# Altium project IPG.PrjPcb (part 11 of 13)

## Sheet 13-Digital.SchDoc: Digital Sense Channel
size A2; Date: 18/12/2023; DocumentNumber: 13; SheetNumber: 13; SheetTotal: 15
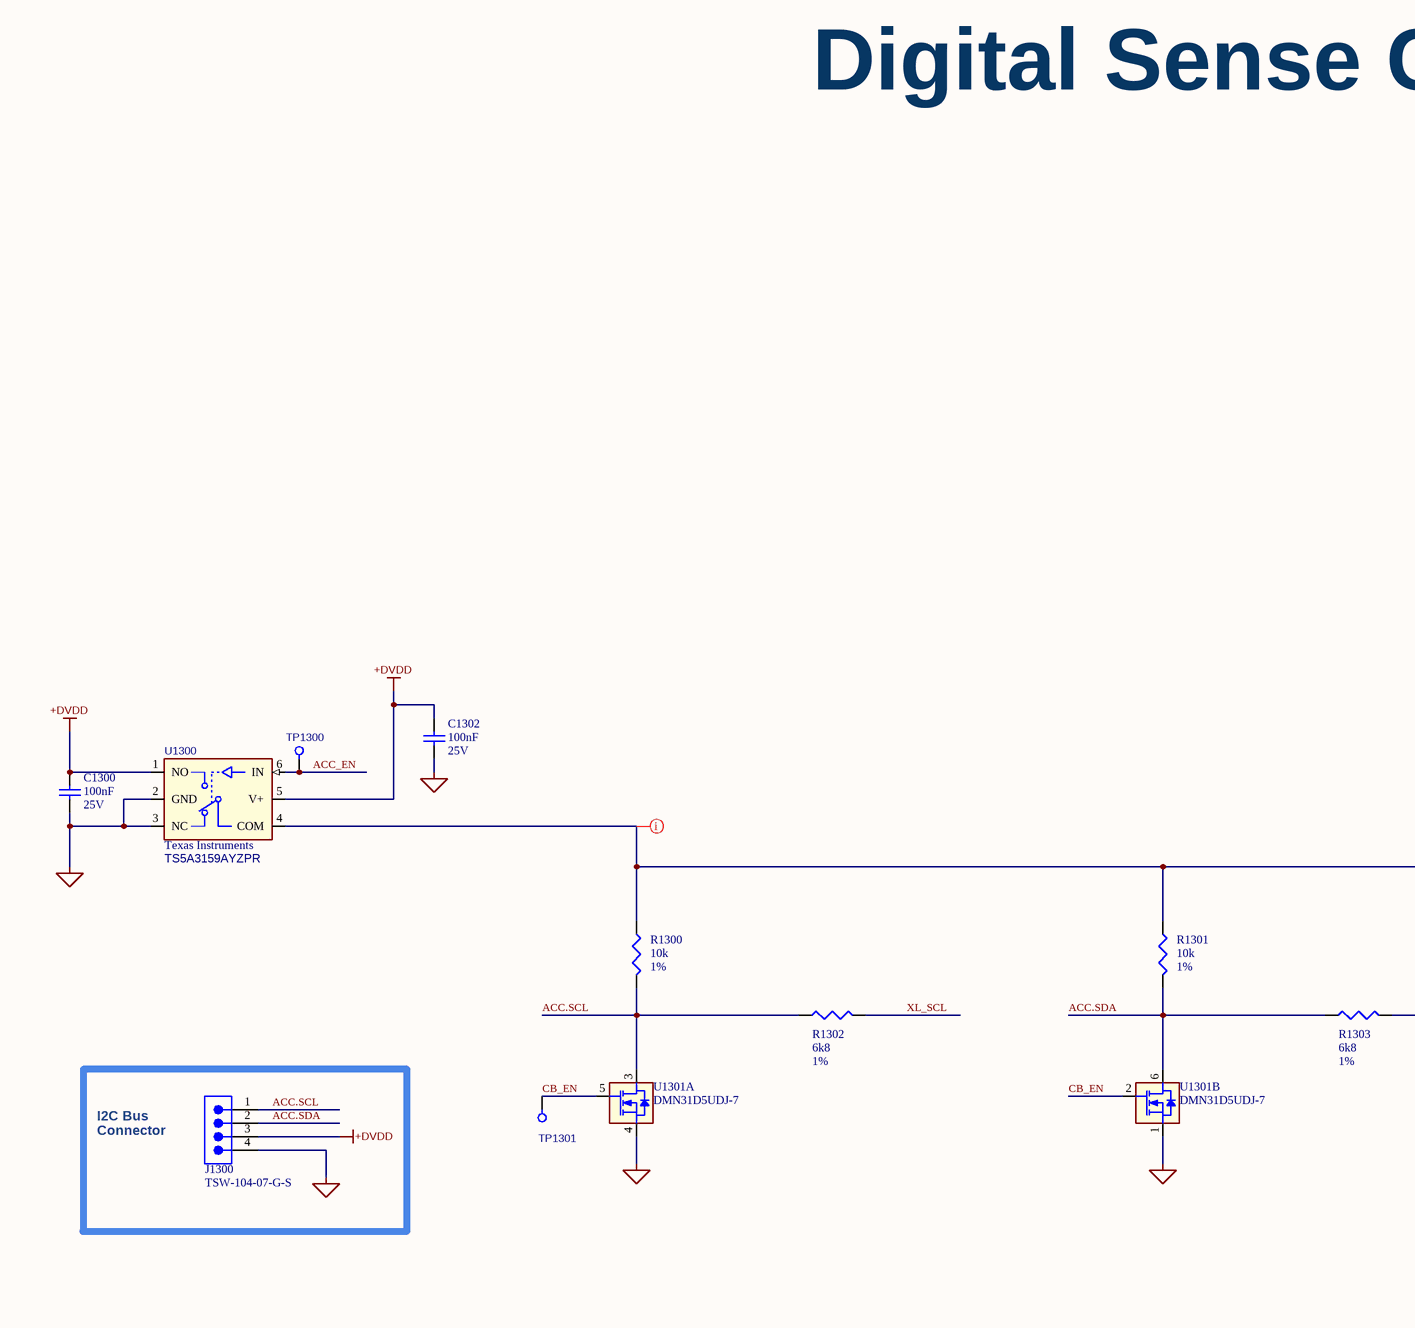
[diagram p27: 13-Digital.SchDoc, left]
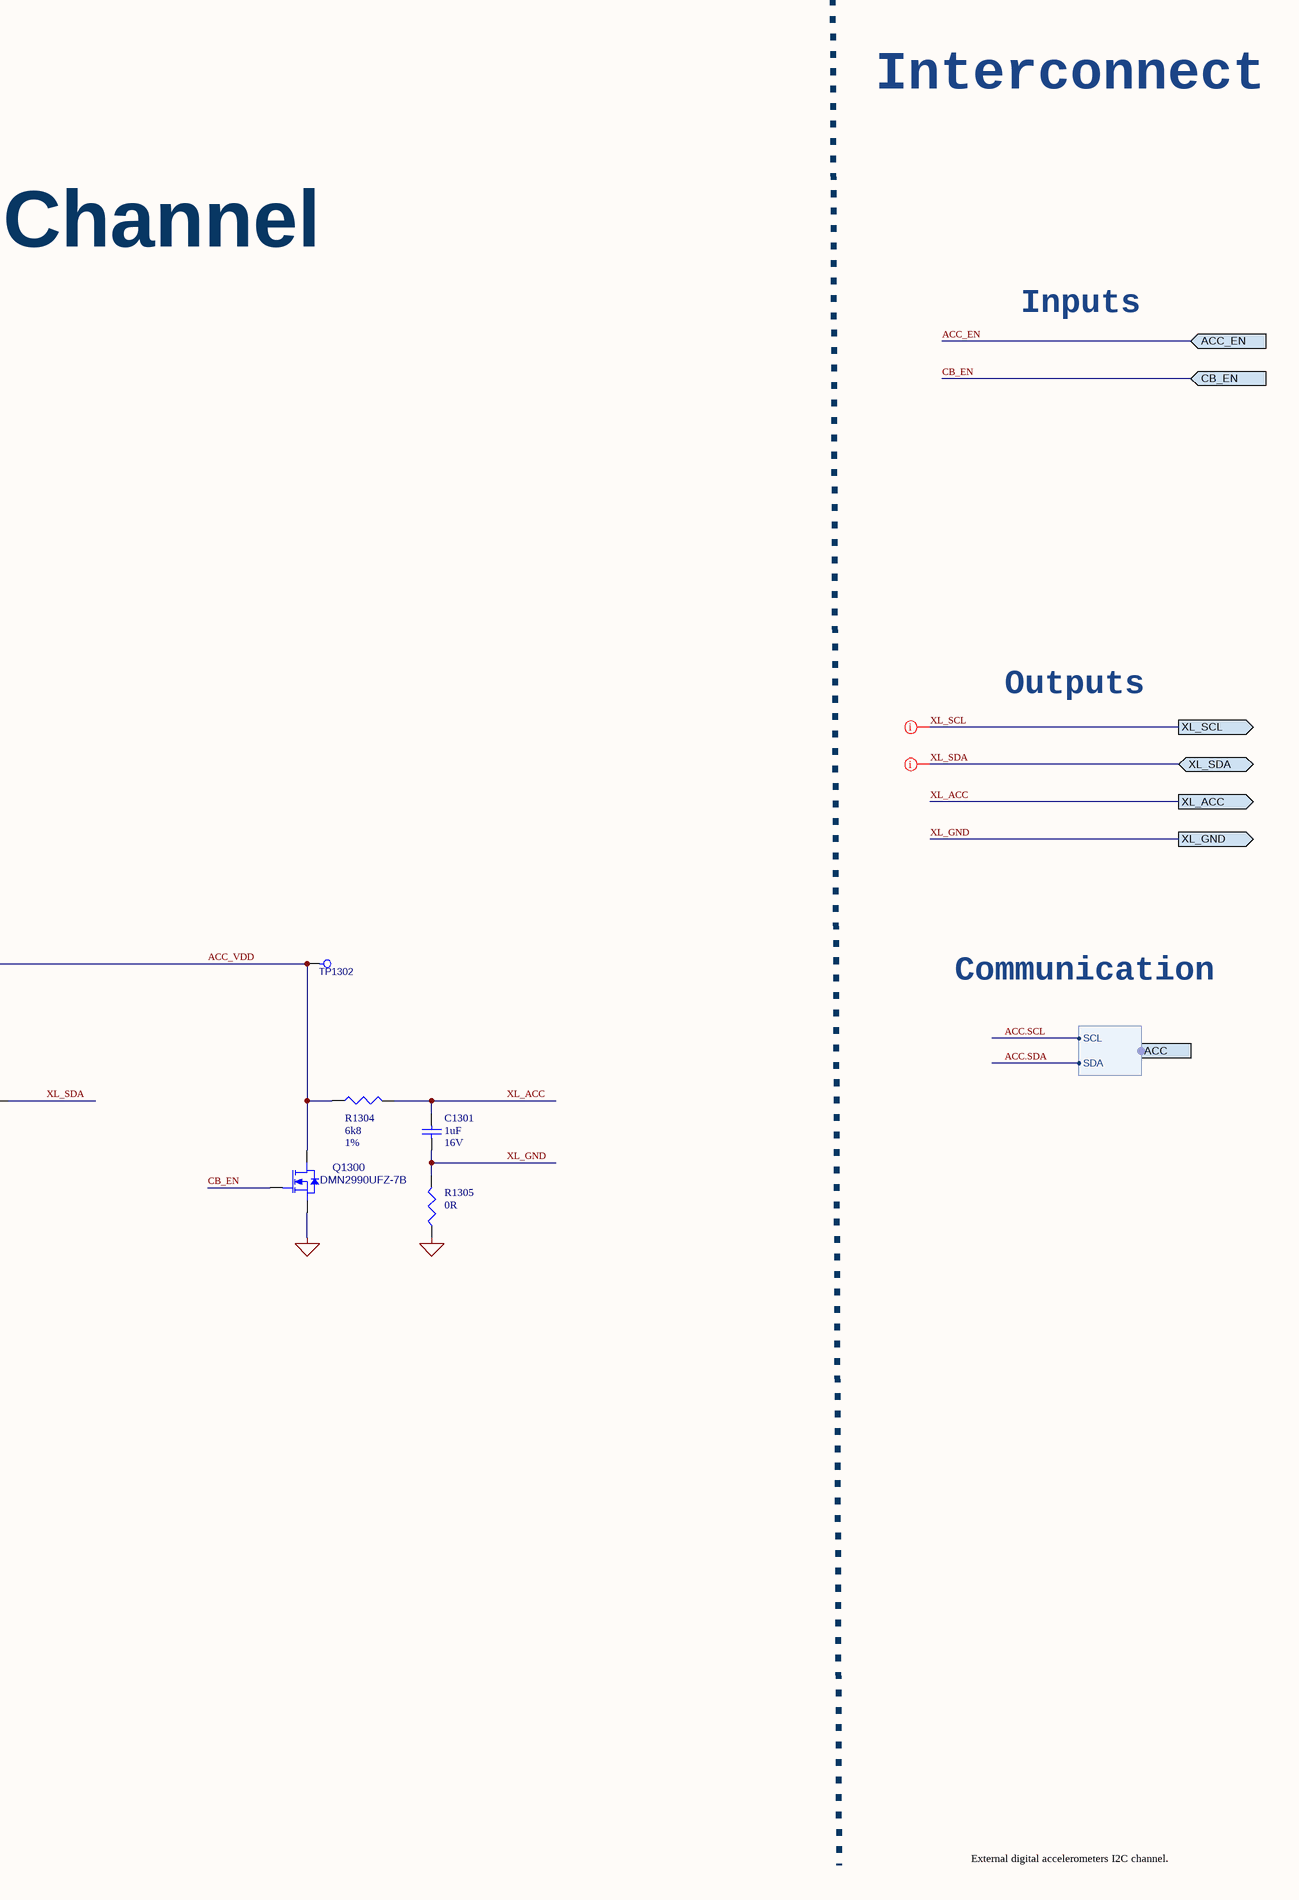
[diagram p28: 13-Digital.SchDoc, right]

### Parts
C1300  value 100nF  Rated DC Voltage (URdc): 25V  [C0201_C]  (hidden comment: GRM033R61E104KE14J)
C1301  value 1uF  Rated DC Voltage (URdc): 16V  [C0201_C]  (hidden comment: GRM033R61C105ME15D)
C1302  value 100nF  Rated DC Voltage (URdc): 25V  [C0201_C]  (hidden comment: GRM033R61E104KE14J)
J1300  TSW-104-07-G-S  [SMTC-TSW-104-07-X-S]
Q1300  DMN2990UFZ-7B  [DIODESINC_X2-DFN0606-3]
R1300  value 10k  Tolerance: 1%  [R0201_C]  (hidden comment: CRCW020110K0FNED)
R1301  value 10k  Tolerance: 1%  [R0201_C]  (hidden comment: CRCW020110K0FNED)
R1302  value 6k8  Tolerance: 1%  [R0201_C]  (hidden comment: CRCW02016K80FNED)
R1303  value 6k8  Tolerance: 1%  [R0201_C]  (hidden comment: CRCW02016K80FNED)
R1304  value 6k8  Tolerance: 1%  [R0201_C]  (hidden comment: CRCW02016K80FNED)
R1305  value 0R  [R0201_C]  (hidden comment: CRCW02010000Z0ED)
TP1300  Test Point  [testpad_0.9mm]  (value not drawn)  (no BOM)
TP1301  Test Point  [testpad_0.9mm]  (value not drawn)  (no BOM)
TP1302  Test Point  [testpad_0.9mm]  (value not drawn)  (no BOM)
U1300  Manufacturer: Texas Instruments  [TI_YZP6]  (hidden comment: TS5A3159AYZPR)
U1301  DMN31D5UDJ-7  [DIODESINC_SOT-963-6]  (parts A,B of 2)

### Ports
ACC (harness I2C), ACC_EN (in), CB_EN (in), XL_ACC (out), XL_GND (out), XL_SCL (out), XL_SDA (bidir)

### Harnesses
I2C: SDA, SCL

### Nets
+DVDD: C1300.2 C1302.2 J1300.3 U1300.1(NO) U1300.5(V+)
GND: C1300.1 C1302.1 J1300.4 Q1300.2(S) R1305.1 U1300.2(GND) U1300.3(NC) U1301.1 U1301.4
ACC.SCL: J1300.1 R1300.2 R1302.1 U1301.3 ; port ACC.SCL
ACC.SDA: J1300.2 R1301.2 R1303.1 U1301.6 ; port ACC.SDA
ACC_EN: TP1300.1 U1300.6(IN) ; port ACC_EN
ACC_VDD: Q1300.3(D) R1300.1 R1301.1 R1304.1 TP1302.1 U1300.4(COM)
CB_EN: Q1300.1(G) TP1301.1 U1301.2 U1301.5 ; port CB_EN
XL_ACC: C1301.2 R1304.2 ; port XL_ACC
XL_GND: C1301.1 R1305.2 ; port XL_GND
XL_SCL: R1302.2 ; port XL_SCL
XL_SDA: R1303.2 ; port XL_SDA

### Layout directives
net class DIGITAL: XL_SCL, XL_SDA
rule Supply Nets [Voltage = 3.300]; net class POWER: ACC_VDD

### Notes on the sheet
- Interconnect
- Digital Sense Channel
- Inputs
- Outputs
- Communication
- (near J1300) I2C Bus
  Connector
- External digital accelerometers I2C channel.
- Project:
- Schematic:
- Design by:
- Date:
- Ver:
- .
- Comments:
- Reviewed by:

### Library data of the parts
C1300 C1302 = GRM033R61E104KE14J: as C1003-C1006 on sheet 10-Sensing; ComponentLink2Description: http://www.mouser.com/ds/2/281/c02e-2905.pdf?src-supplier=Mouser; Height: 0.3mm; ComponentLink2URL: http://www.mouser.com/ds/2/281/c02e-2905.pdf?src-supplier=Mouser; RoHS: Yes; Category: Ceramic Capacitors; Manufacturer Part Number: GRM033R61E104KE14J; Case/Package: 0201; Dielectric Material: Ceramic; Min Operating Temperature: -55°C; Max Operating Temperature: 85°C; Packaging: Tape and Reel; Termination: Wraparound; Length: 0.6mm; Width: 0.3mm; Reach SVHC Compliant: Yes; RoHS Compliant: Yes; ComponentLink1URL: https://psearch.en.murata.com:443/capacitor/product/GRM033R61E104KE14%23.pdf?src-supplier=IHS+Markit; ComponentLink1Description: https://psearch.en.murata.com:443/capacitor/product/GRM033R61E104KE14%23.pdf?src-supplier=IHS+Markit; ComponentLink3URL: http://search.murata.co.jp/Ceramy/image/img/A01X/G101/ENG/GRM033R61E104KE14-01.pdf?src-supplier=Digikey; ComponentLink3Description: http://search.murata.co.jp/Ceramy/image/img/A01X/G101/ENG/GRM033R61E104KE14-01.pdf?src-supplier=Digikey; ComponentLink4URL: https://search.murata.co.jp/Ceramy/image/img/A01X/G101/ENG/GRM033R61E104KE14-01.pdf?src-supplier=Digikey; ComponentLink4Description: https://search.murata.co.jp/Ceramy/image/img/A01X/G101/ENG/GRM033R61E104KE14-01.pdf?src-supplier=Digikey; Supplier: Digikey; Supplier Part Number: 490-14571-1-ND; Stock: 1540851; Pricing: 1=0,1, 10=0,033, 50=0,0192, 100=0,0148, 500=0,01118, 1000=0,00878, 2500=0,00798, 5000=0,00734 (USD); Mounting Technology: Surface Mount; Pins: 2; Package Shape: Rectangular; Terminal Finish: Nickel; JESD-609 Code: e3; Capacitor Type: Ceramic; Tolerance  (fill in as +-): 10%; Package Style: SMTMeter; Tolerance (fill in as +-): 10%; Temperature Characteristics Code: X5R; Supplier 1: Arrow Electronics; Supplier Part Number 1: GRM033R61E104KE14J
C1301 = GRM033R61C105ME15D: Ceramic Capacitor, Multilayer, Ceramic, 16V, 20% +Tol, 20% -Tol, X5R, 15% TC, 1uF, Surface Mount, 0201; Manufacturer: Murata; Supplier: Digikey; Supplier Part Number: 490-18654-1-ND; Manufacturer Part Number: GRM033R61C105ME15D; RoHS: No; Category: Ceramic Capacitors; Stock: 132893; Pricing: 1=0,16, 10=0,105, 50=0,0628, 100=0,0493, 500=0,03644, 1000=0,03017, 2500=0,02808, 5000=0,02569 (USD); Supplier 1: Avnet; Supplier Part Number 1: GRM033R61C105ME15D
J1300 = TSW-104-07-G-S: Board Connector, 4 Contact(s), 1 Row(s), Male, Straight, 0.1 inch Pitch, Solder Terminal, Black Insulator, Receptacle; Manufacturer: Samtec; PartNumber: TSW-106-07-G-S; Pitch: 2.54 mm; Option: General Purpose; Filter Feature: No; Number of Rows Loaded: 1; Number of Contacts: 4; Additional Feature: E.L.P.; Contact Pattern: RECTANGULAR; Contact Style: SQ PIN-SKT; Mating Information: MULTIPLE MATING PARTS AVAILABLE; Plating Thickness: 10uin; Reference Standard: UL; Reliability: COMMERCIAL; RoHS: True; ComponentLink1Description: Manufacturer URL; DatasheetVersion: F-214; Orientation: Vertical; ComponentLink1URL: http://www.samtec.com; ComponentLink3Description: Package Specification; ComponentLink2Description: Datasheet; PackageVersion: DM, 8/1988; PackageDescription: .025[0.64] SQ. Post Terminal Strip Assembly; PackageReference: TSW-106-07-X-S; Mounting Technology: Through-hole; Temperature Range: -55 to 125 degC; ComponentLink3URL: http://www.samtec.com/documents/webfiles/cpdf/TSW-XXX-XX-XXX-X-XX-XXX-MKT.pdf; ComponentLink2URL: http://www.samtec.com/documents/webfiles/pdf/TSW_TH.PDF; Supplier: Arrow Electronics; Supplier Part Number: TSW-104-07-G-S; Manufacturer Part Number: TSW-104-07-G-S; Category: Board to Board Connectors; Stock: 5100; Pricing: 1=0,59, 50=0,46, 100=0,37, 500=0,32, 1000=0,24, 2000=0,21, 5000=0,15 (USD); Contact Finish - Termination: Gold (Au) - with Nickel (Ni) barrier; Contact Material: Bronze; Contact Finish - Mating: GOLD (10) OVER NICKEL (50); Insulation Color: Black; Insulation Material: Glass; Connector Type: BOARD CONNECTOR; JESD-609 Code: e4; Contact Gender: Male; Mixed Contacts: No; Mounting Style: STRAIGHT; Termination: Solder; Number Of Connectors: 1; Number Of PCB Rows: 1; PCB Contact Pattern: RECTANGULAR; Body/Shell Style: RECEPTACLE; Terminal Pitch: 2.54mm; Mating Contact Pitch: 0.1inch; Body Breadth: 0.1inch; Body Depth: 0.1inch; Terminal Length: 0.1inch; Flammability Rating: UL94 V-0; DIN Conformance: No; IEC Conformance: No; MIL Conformance: No; Reach SVHC Compliant: Yes; RoHS Compliant: Yes; ComponentLink4URL: https://datasheet.ciiva.com:443/pdfs/VipMasterIC/IC/SAMI/SAMI-S-A0003531373/SAMI-S-A0003531373-1.pdf?src-supplier=IHS+Markit; ComponentLink4Description: https://datasheet.ciiva.com:443/pdfs/VipMasterIC/IC/SAMI/SAMI-S-A0003531373/SAMI-S-A0003531373-1.pdf?src-supplier=IHS+Markit; ComponentLink5URL: https://datasheet.ciiva.com/6889/tsw-xxx-xx-xxx-x-xx-xxx-mkt-6889291.pdf?src-supplier=Digi-Key; ComponentLink5Description: https://datasheet.ciiva.com/6889/tsw-xxx-xx-xxx-x-xx-xxx-mkt-6889291.pdf?src-supplier=Digi-Key; Supplier 1: Digikey; Supplier Part Number 1: SAM1029-04-ND
Q1300 = DMN2990UFZ-7B: as M500 on sheet 05-WPT; Category: Transistor; Length (mm): 0.62 ±0.05; Medical Grade MFR PN: TBD; PCB Footprint: TBD; Rating: 20V; Thickness (mm): 0.38 ±0.02; Width (mm): 0.62 ±0.05; Supplier 1: Digi-Key; Supplier Part Number 1: DMN2990UFZ-7BDICT-ND; Value: DMN2990UFZ-7B; Status: Approved; Manufacturer Part Number: DMN2990UFZ-7B
R1300 R1301 = CRCW020110K0FNED: Fixed Resistor, Metal Glaze/thick Film, 0.05W, 10000ohm, 30V, 1% +/-Tol, 200ppm/Cel, Surface Mount, 0201; Manufacturer: Vishay; Medical Grade MFR: Mini-Systems; Medical Grade MFR PN: MWA96SM-1002F-NS62TR; Temperature Coefficient: 200ppm/°C; Power: 50mW; Rated Temperature: 70°C; Package Height: 0.23mm; Package Length: 0.6mm; Package Width: 0.3mm; Reference Standard: AEC-Q200; Termination: Wraparound; Packaging: Tape and Reel; Case/Package: 0201; Min Operating Temperature: -55°C; Max Operating Temperature: 155°C; Manufacturer Part Number: CRCW020110K0FNED; RoHS: Yes; Category: Chip SMD Resistors; Resistor Type: FIXED RESISTOR; Construction: Chip; Technology: METAL GLAZE/THICK FILM; RoHS Compliant: Yes; ComponentLink1URL: https://datasheet.ciiva.com:443/pdfs/VipMasterIC/IC/VISH/VISH-S-A0002932828/VISH-S-A0002932828-1.pdf?src-supplier=IHS+Markit; ComponentLink1Description: https://datasheet.ciiva.com:443/pdfs/VipMasterIC/IC/VISH/VISH-S-A0002932828/VISH-S-A0002932828-1.pdf?src-supplier=IHS+Markit; ComponentLink2URL: https://datasheet.ciiva.com/2474/crcw0201e3-2474819.pdf?src-supplier=Digikey; ComponentLink2Description: https://datasheet.ciiva.com/2474/crcw0201e3-2474819.pdf?src-supplier=Digikey; ComponentLink3URL: https://datasheet.ciiva.com/2474/crcw0201e3-2474820.pdf?src-supplier=Digikey; ComponentLink3Description: https://datasheet.ciiva.com/2474/crcw0201e3-2474820.pdf?src-supplier=Digikey; ComponentLink4URL: https://datasheet.ciiva.com/2474/crcw0201e3-2474818.pdf?src-supplier=Digikey; ComponentLink4Description: https://datasheet.ciiva.com/2474/crcw0201e3-2474818.pdf?src-supplier=Digikey; Supplier: Digikey; Supplier Part Number: 541-10.0KABCT-ND; Stock: 1011530; Pricing: 1=0,1, 10=0,037, 50=0,0242, 100=0,0204, 500=0,01426, 1000=0,01241, 5000=0,00924 (USD); Mounting Technology: Surface Mount; Pins: 2; Package Shape: Rectangular; Terminal Finish: Nickel; JESD-609 Code: e3; Package Style: SMTMeter; Working Voltage: 30V; Reach SVHC Compliant: Yes; ComponentLink5URL: https://datasheet.ciiva.com/16436/dcrcwe3-16436222.pdf?src-supplier=Future+Electronics; ComponentLink5Description: https://datasheet.ciiva.com/16436/dcrcwe3-16436222.pdf?src-supplier=Future+Electronics; ComponentLink6URL: https://datasheet.ciiva.com/7983/1719906-7983320.pdf?src-supplier=Element14; ComponentLink6Description: https://datasheet.ciiva.com/7983/1719906-7983320.pdf?src-supplier=Element14; ComponentLink7URL: https://datasheet.ciiva.com/7983/1719906-7983319.pdf?src-supplier=Element14; ComponentLink7Description: https://datasheet.ciiva.com/7983/1719906-7983319.pdf?src-supplier=Element14; ComponentLink8URL: https://datasheet.ciiva.com/22692/1719906-22692709.pdf?src-supplier=Element14; ComponentLink8Description: https://datasheet.ciiva.com/22692/1719906-22692709.pdf?src-supplier=Element14; Supplier 1: Mouser; Supplier Part Number 1: 71-CRCW0201-10K
R1302-R1304 = CRCW02016K80FNED: Fixed Resistor, Metal Glaze/thick Film, 0.05W, 6800ohm, 30V, 1% +/-Tol, 200ppm/Cel, Surface Mount, 0201; Manufacturer: Vishay; Medical Grade MFR: Mini-Systems; Medical Grade MFR PN: MWA96SM-6801F-NS62TR; Temperature Coefficient: 200ppm/°C; Power: 50mW; Rated Temperature: 70°C; Package Height: 0.23mm; Package Length: 0.6mm; Package Width: 0.3mm; Reference Standard: AEC-Q200; Max Operating Temperature: 155°C; Working Voltage: 30V; Packaging: Tape and Reel; Min Operating Temperature: -55°C; Case/Package: 0201; Manufacturer Part Number: CRCW02016K80FNED; RoHS: Yes; Category: Chip SMD Resistors; Resistor Type: FIXED RESISTOR; Construction: Chip; Technology: METAL GLAZE/THICK FILM; RoHS Compliant: Yes; ComponentLink1URL: https://datasheet.ciiva.com:443/pdfs/VipMasterIC/IC/VISH/VISH-S-A0002932828/VISH-S-A0002932828-1.pdf?src-supplier=IHS+Markit; ComponentLink1Description: https://datasheet.ciiva.com:443/pdfs/VipMasterIC/IC/VISH/VISH-S-A0002932828/VISH-S-A0002932828-1.pdf?src-supplier=IHS+Markit; ComponentLink2URL: https://datasheet.ciiva.com/2577/crcw0201e3-2577241.pdf?src-supplier=Digikey; ComponentLink2Description: https://datasheet.ciiva.com/2577/crcw0201e3-2577241.pdf?src-supplier=Digikey; ComponentLink3URL: https://datasheet.ciiva.com/9060/crcw0201e3-9060860.pdf?src-supplier=Avnet; ComponentLink3Description: https://datasheet.ciiva.com/9060/crcw0201e3-9060860.pdf?src-supplier=Avnet; ComponentLink4URL: https://datasheet.ciiva.com/22674/1700795-22674684.pdf?src-supplier=Element14; ComponentLink4Description: https://datasheet.ciiva.com/22674/1700795-22674684.pdf?src-supplier=Element14; ComponentLink5URL: https://datasheet.ciiva.com/22700/1719906-22700351.pdf?src-supplier=Element14; ComponentLink5Description: https://datasheet.ciiva.com/22700/1719906-22700351.pdf?src-supplier=Element14; ComponentLink6URL: https://datasheet.ciiva.com/7672/1719906-7672744.pdf?src-supplier=Element14; ComponentLink6Description: https://datasheet.ciiva.com/7672/1719906-7672744.pdf?src-supplier=Element14; ComponentLink7URL: https://datasheet.ciiva.com/7672/1719906-7672745.pdf?src-supplier=Element14; ComponentLink7Description: https://datasheet.ciiva.com/7672/1719906-7672745.pdf?src-supplier=Element14; Supplier: Digikey; Supplier Part Number: 541-CRCW02016K80FNEDCT-ND; Stock: 40938; Pricing: 1=0,1, 10=0,037, 50=0,0242, 100=0,0204, 500=0,01426, 1000=0,01241, 5000=0,00924 (USD); Mounting Technology: Surface Mount; Pins: 2; Package Shape: Rectangular; Terminal Finish: Nickel; JESD-609 Code: e3; Package Style: SMTMeter; Termination: Wraparound; Reach SVHC Compliant: Yes; Supplier 1: Digikey; Supplier Part Number 1: 541-CRCW02016K80FNEDCT-ND
R1305 = CRCW02010000Z0ED: as R1013 on sheet 10-Sensing; Category: Chip SMD Resistors; Supplier: Digikey; Supplier Part Number: 541-0.0AGCT-ND; Manufacturer Part Number: CRCW02010000Z0ED; RoHS: Yes; Stock: 701366; Pricing: 1=0,1, 10=0,034, 25=0,026, 50=0,0198, 100=0,0138, 250=0,01112, 500=0,0089, 1000=0,00655, 5000=0,0047 (USD); Mounting Technology: Surface Mount; Pins: 2; Package Shape: Rectangular; Case/Package: 0201; Terminal Finish: Nickel; Min Operating Temperature: -55°C; Max Operating Temperature: 155°C; JESD-609 Code: e3; Resistor Type: FIXED RESISTOR; Construction: Chip; Package Style: SMTMeter; Packaging: Tape and Reel; Technology: METAL GLAZE/THICK FILM; Termination: Wraparound; Reach SVHC Compliant: Yes; RoHS Compliant: Yes; ComponentLink1URL: https://datasheet.ciiva.com:443/pdfs/VipMasterIC/IC/VISH/VISH-S-A0002932828/VISH-S-A0002932828-1.pdf?src-supplier=IHS+Markit; ComponentLink1Description: https://datasheet.ciiva.com:443/pdfs/VipMasterIC/IC/VISH/VISH-S-A0002932828/VISH-S-A0002932828-1.pdf?src-supplier=IHS+Markit; ComponentLink2URL: https://datasheet.ciiva.com/2471/crcw0201e3-2471712.pdf?src-supplier=Digikey; ComponentLink2Description: https://datasheet.ciiva.com/2471/crcw0201e3-2471712.pdf?src-supplier=Digikey; ComponentLink3URL: https://datasheet.ciiva.com/7841/1719906-7841431.pdf?src-supplier=Element14; ComponentLink3Description: https://datasheet.ciiva.com/7841/1719906-7841431.pdf?src-supplier=Element14; ComponentLink4URL: https://datasheet.ciiva.com/7841/1719906-7841430.pdf?src-supplier=Element14; ComponentLink4Description: https://datasheet.ciiva.com/7841/1719906-7841430.pdf?src-supplier=Element14; ComponentLink5URL: https://datasheet.ciiva.com/22665/1847332-22665688.pdf?src-supplier=Element14; ComponentLink5Description: https://datasheet.ciiva.com/22665/1847332-22665688.pdf?src-supplier=Element14; ComponentLink6URL: https://datasheet.ciiva.com/2471/crcw0201e3-2471713.pdf?src-supplier=Digikey; ComponentLink6Description: https://datasheet.ciiva.com/2471/crcw0201e3-2471713.pdf?src-supplier=Digikey; ComponentLink7URL: https://datasheet.ciiva.com/2471/crcw0201e3-2471711.pdf?src-supplier=Digikey; ComponentLink7Description: https://datasheet.ciiva.com/2471/crcw0201e3-2471711.pdf?src-supplier=Digikey; ComponentLink8URL: https://datasheet.ciiva.com/16757/70202042-16757849.pdf?src-supplier=Allied+Electronics; ComponentLink8Description: https://datasheet.ciiva.com/16757/70202042-16757849.pdf?src-supplier=Allied+Electronics; ComponentLink9URL: https://datasheet.ciiva.com/16436/crcw0201e3-16436237.pdf?src-supplier=Future+Electronics; ComponentLink9Description: https://datasheet.ciiva.com/16436/crcw0201e3-16436237.pdf?src-supplier=Future+Electronics; Supplier 1: Digikey; Supplier Part Number 1: 541-0.0AGDKR-ND
TP1300-TP1302 = Test Point: as TP1000 on sheet 10-Sensing; Length (mm): 0.90; Manufacturer: N/A; Manufacturer PN: N/A; Medical Grade MFR: N/A; Medical Grade MFR PN: N/A; Rating: N/A; Thickness (mm): N/A; Value: Test point; Width (mm): 0.90; Category: Test point; Status: *; Review: *
U1300 = TS5A3159AYZPR: as U1103 on sheet 11-Stimulation; Category: IC; Length (mm): 1.39 ±0.03; Thickness (mm): 0.50 ±0.10; Width (mm): 0.89 ±0.03; Medical Grade MFR PN: TBD; Package Description: TBD; PCB Footprint: TBD; Supplier 1: Digi-Key; Supplier Part Number 1: 296-18671-1-ND; Status: *; Review: *; Value: TS5A3159AYZPR; Manufacturer Part Number: TS5A3159AYZPR
U1301 = DMN31D5UDJ-7: as U506 on sheet 05-WPT; Manufacturer Part Number: DMN31D5UDJ-7; Category: Transistors; Vds(Max): 30V; Type: MOSFET array; RoHs: RoHS 2; Package: SOT-963; Supplier 1: Digikey; Supplier Part Number 1: 31-DMN31D5UDJ-7CT-ND